# Altium project PCB_Project.PrjPcb
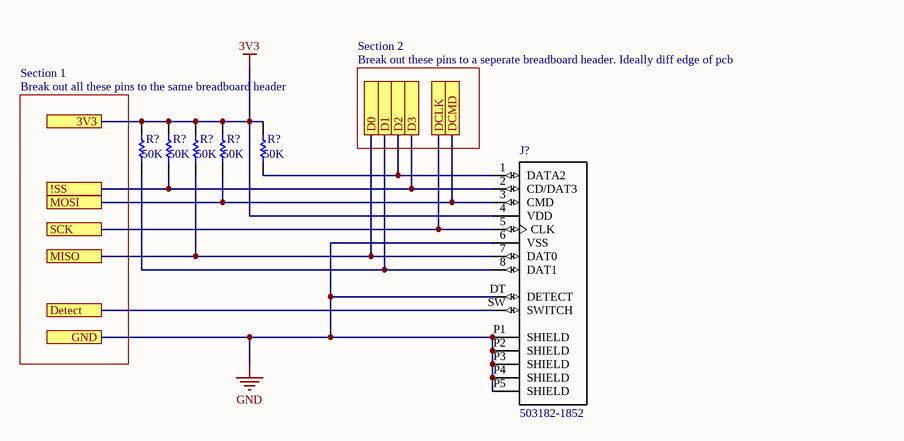
[diagram p0: SDCard.SchDoc]
5 sheets, 27 parts. Net scope: flat (ports and power ports of the same name join across sheets).
Sheets:
  SDCard.SchDoc
  GPS.SchDoc
  Analog.SchDoc
  CAN.SchDoc
  STM32_Base.SchDoc

## Sheet SDCard.SchDoc
size A

### Parts
(Parts that share a designator on the sheet are numbered #1, #2 ... from top to bottom, then left to right.)
J?  503182-1852  [*MOLEX_503182-1852_503182-1852(Primary)]
R?#1  value 50K  [AXIAL-0.3]  (hidden comment: Res1)
R?#2  value 50K  [AXIAL-0.3]  (hidden comment: Res1)
R?#3  value 50K  [AXIAL-0.3]  (hidden comment: Res1)
R?#4  value 50K  [AXIAL-0.3]  (hidden comment: Res1)
R?#5  value 50K  [AXIAL-0.3]  (hidden comment: Res1)

### Sub-sheets
Section 1 = Break out all these pins to the same breadboard header (file not in this document): no entries
Section 2 = Break out these pins to a seperate breadboard header. Ideally diff edge of pcb (file not in this document): no entries

### Ports
3V3, !SS, D0, D1, D2, D3, DCLK, DCMD, Detect, GND, MISO, MOSI, SCK

### Nets
3V3: J?.4(VDD) R?#1.1 R?#2.1 R?#3.1 R?#4.1 R?#5.1 ; port 3V3
GND: J?.6(VSS) J?.DT(DETECT) J?.P1(SHIELD) J?.P2(SHIELD) J?.P3(SHIELD) J?.P4(SHIELD) J?.P5(SHIELD) ; port GND
NetJ?_1: J?.1(DATA2) R?#5.2 ; port D2
NetJ?_2: J?.2(CD/DAT3) R?#2.2 ; port !SS, port D3
NetJ?_3: J?.3(CMD) R?#4.2 ; port MOSI, port DCMD
NetJ?_5: J?.5(CLK) ; port SCK, port DCLK
NetJ?_7: J?.7(DAT0) R?#3.2 ; port MISO, port D0
NetJ?_8: J?.8(DAT1) R?#1.2 ; port D1
NetJ?_SW: J?.SW(SWITCH) ; port Detect

### Library data of the parts
J? = 503182-1852: / 10 _8 + 2_ Position Card Connector microSDâ„¢ Surface Mount, Right Angle Gold /; MF: Molex; MP: 5031821852; Digi-Key_Purchase_URL: https://www.digikey.com/product-detail/en/molex/5031821852/WM12834CT-ND/5823232?utm_source=snapeda&utm_medium=aggregator&utm_campaign=symbol; Package: None; SnapEDA_Link: https://www.snapeda.com/parts/5031821852/Molex/view-part/46835/?ref=snap; Digi-Key_Part_Number: WM12834CT-ND; Value: *
R?#1-R?#5 = Res1: Resistor; Published: 8-Jun-2000; LatestRevisionDate: 17-Jul-2002; LatestRevisionNote: Re-released for DXP Platform.; PackageReference: AXIAL-0.3; Publisher: Altium Limited; PackageDescription: Axial Device, Thru-Hole; 2 Leads; 0.3 in Pin Spacing

## Sheet GPS.SchDoc
size A
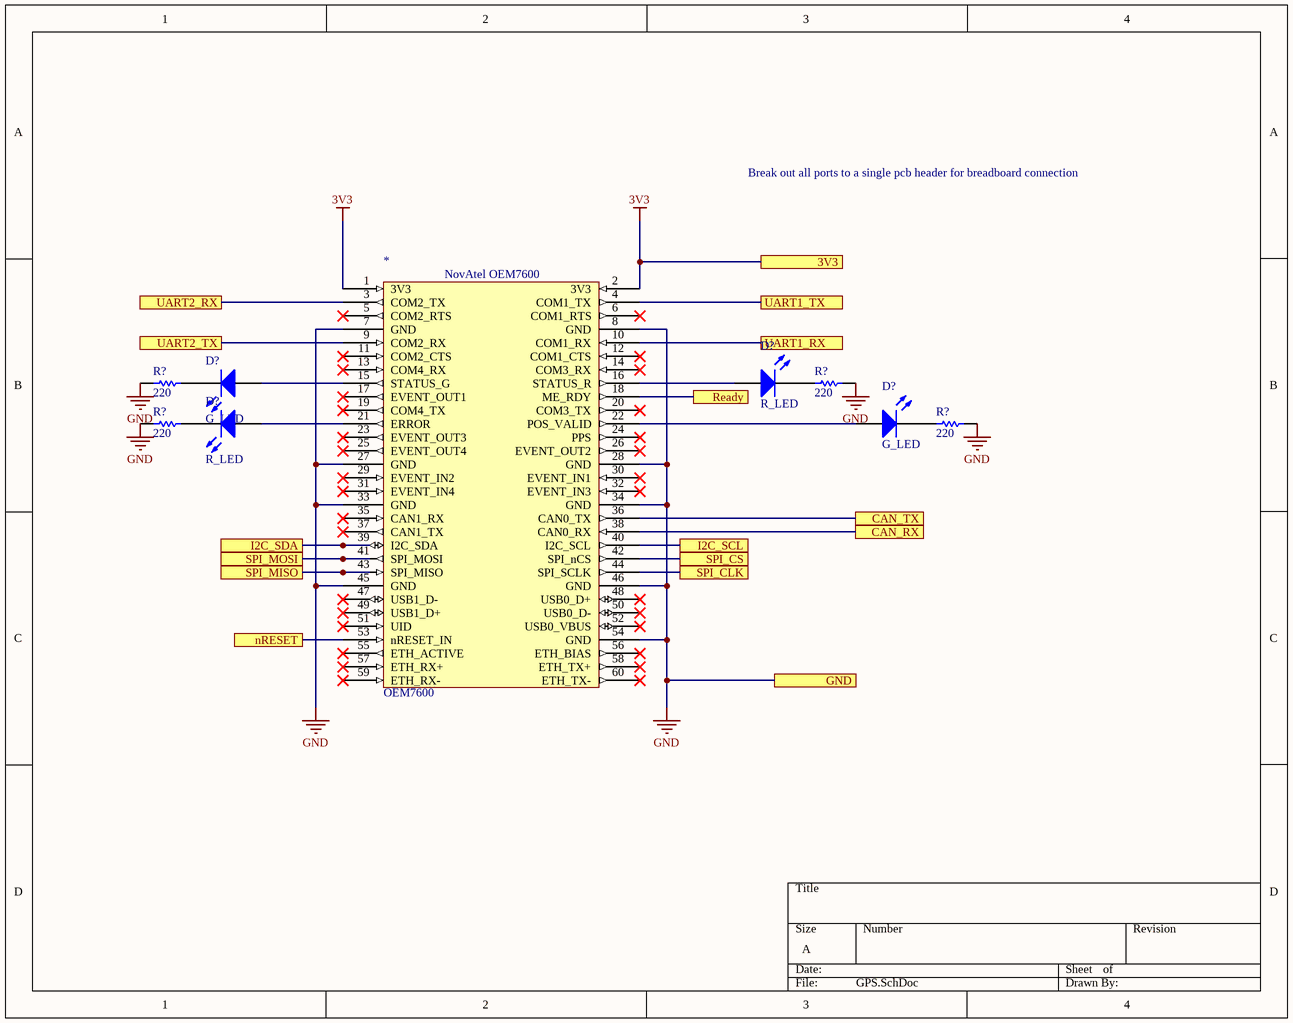
[diagram p1: GPS.SchDoc]

### Parts
(Parts that share a designator on the sheet are numbered #1, #2 ... from top to bottom, then left to right.)
*  OEM7600
D?#1  R_LED  [3.2X1.6X1.1]
D?#2  G_LED  [3.2X1.6X1.1]
D?#3  G_LED  [3.2X1.6X1.1]
D?#4  R_LED  [3.2X1.6X1.1]
R?#6  value 220  [AXIAL-0.3]  (hidden comment: Res1)
R?#7  value 220  [AXIAL-0.3]  (hidden comment: Res1)
R?#8  value 220  [AXIAL-0.3]  (hidden comment: Res1)
R?#9  value 220  [AXIAL-0.3]  (hidden comment: Res1)

### Ports
3V3, CAN_RX, CAN_TX, GND, I2C_SCL, I2C_SDA, nRESET, Ready, SPI_CLK, SPI_CS, SPI_MISO, SPI_MOSI, UART1_RX, UART1_TX, UART2_RX, UART2_TX

### Nets
3V3: *.1(3V3) *.2(3V3) ; port 3V3
GND: *.7(GND) *.8(GND) *.27(GND) *.28(GND) *.33(GND) *.34(GND) *.45(GND) *.46(GND) *.54(GND) R?#6.1 R?#7.2 R?#8.1 R?#9.2 ; port GND
Net*_3: *.3(COM2_TX) ; port UART2_RX
Net*_4: *.4(COM1_TX) ; port UART1_TX
Net*_9: *.9(COM2_RX) ; port UART2_TX
Net*_10: *.10(COM1_RX) ; port UART1_RX
Net*_15: *.15(STATUS_G) D?#2.1(A)
Net*_16: *.16(STATUS_R) D?#1.1(A)
Net*_18: *.18(ME_RDY) ; port Ready
Net*_21: *.21(ERROR) D?#4.1(A)
Net*_22: *.22(POS_VALID) D?#3.1(A)
Net*_36: *.36(CAN0_TX) ; port CAN_TX
Net*_38: *.38(CAN0_RX) ; port CAN_RX
Net*_39: *.39(I2C_SDA) ; port I2C_SDA
Net*_40: *.40(I2C_SCL) ; port I2C_SCL
Net*_41: *.41(SPI_MOSI) ; port SPI_MOSI
Net*_42: *.42(SPI_nCS) ; port SPI_CS
Net*_43: *.43(SPI_MISO) ; port SPI_MISO
Net*_44: *.44(SPI_SCLK) ; port SPI_CLK
Net*_53: *.53(nRESET_IN) ; port nRESET
NetD?#1_2: D?#1.2(K) R?#7.1
NetD?#2_2: D?#2.2(K) R?#6.2
NetD?#3_2: D?#3.2(K) R?#9.1
NetD?#4_2: D?#4.2(K) R?#8.2

Not connected (* = marked no-connect by the designer): * 5(COM2_RTS)* 6(COM1_RTS)* 11(COM2_CTS)* 12(COM1_CTS)* 13(COM4_RX)* 14(COM3_RX)* 17(EVENT_OUT1)* 19(COM4_TX)* 20(COM3_TX)* 23(EVENT_OUT3)* 24(PPS)* 25(EVENT_OUT4)* 26(EVENT_OUT2)* 29(EVENT_IN2)* 30(EVENT_IN1)* 31(EVENT_IN4)* 32(EVENT_IN3)* 35(CAN1_RX)* 37(CAN1_TX)* 47(USB1_D-)* 48(USB0_D+)* 49(USB1_D+)* 50(USB0_D-)* 51(UID)* 52(USB0_VBUS)* 55(ETH_ACTIVE)* 56(ETH_BIAS)* 57(ETH_RX+)* 58(ETH_TX+)* 59(ETH_RX-)* 60(ETH_TX-)*

### Notes on the sheet
- Break out all ports to a single pcb header for breadboard connection
- (in symbol OEM7600) NovAtel OEM7600

### Library data of the parts
D?#1-D?#4 = LED2: Typical RED, GREEN, YELLOW, AMBER GaAs LED; Published: 8-Jun-2000; LatestRevisionDate: 17-Jul-2002; LatestRevisionNote: Re-released for DXP Platform.; PackageVersion: Feb-2002; PackageReference: 3.2X1.6X1.1; Publisher: Altium Limited; PackageDescription: SM LED; 2 Flat Leads
R?#6-R?#9 = Res1: Resistor; Published: 8-Jun-2000; LatestRevisionDate: 17-Jul-2002; LatestRevisionNote: Re-released for DXP Platform.; PackageReference: AXIAL-0.3; Publisher: Altium Limited; PackageDescription: Axial Device, Thru-Hole; 2 Leads; 0.3 in Pin Spacing
* = OEM7600: ComponentLink1Description: Connector Sheet; ComponentLink1URL: https://docs.novatel.com/OEM7/Content/Technical_Specs_Receiver/OEM7600_Interface_Connector.htm

## Sheet Analog.SchDoc
size A
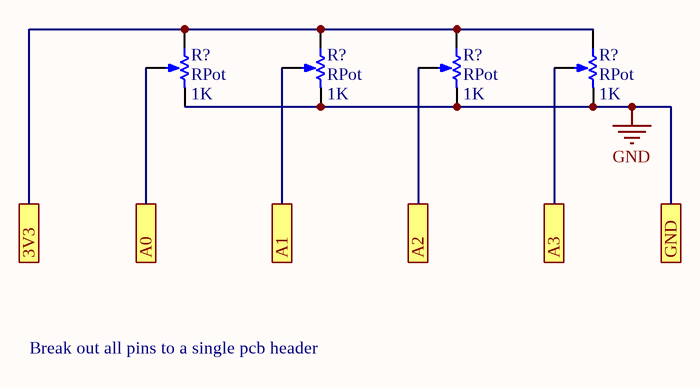
[diagram p2: Analog.SchDoc]

### Parts
(Parts that share a designator on the sheet are numbered #1, #2 ... from top to bottom, then left to right.)
R?#10  RPot  value 1K  [VR5]
R?#11  RPot  value 1K  [VR5]
R?#12  RPot  value 1K  [VR5]
R?#13  RPot  value 1K  [VR5]

### Ports
3V3, A0, A1, A2, A3, GND

### Nets
3V3: R?#10.1(TOP) R?#11.1(TOP) R?#12.1(TOP) R?#13.1(TOP) ; port 3V3
GND: R?#10.2(BOT) R?#11.2(BOT) R?#12.2(BOT) R?#13.2(BOT) ; port GND
NetR?#10_3: R?#10.3(TAP) ; port A0
NetR?#11_3: R?#11.3(TAP) ; port A1
NetR?#12_3: R?#12.3(TAP) ; port A2
NetR?#13_3: R?#13.3(TAP) ; port A3

### Notes on the sheet
- Break out all pins to a single pcb header

### Library data of the parts
R?#10-R?#13 = RPot: Potentiometer; Sim Note: Enter the Resistance value and the set point into parameter fields.; Set Position: 0.5; Published: 8-Jun-2000; LatestRevisionDate: 17-Jul-2002; LatestRevisionNote: Re-released for DXP Platform.; PackageReference: VR5; Publisher: Altium Limited; PackageDescription: Variable Resistor, Thru-Hole; 3 Leads

## Sheet CAN.SchDoc
size A
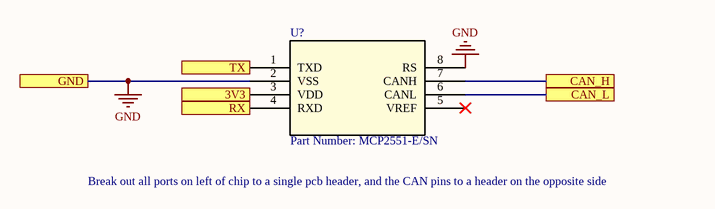
[diagram p3: CAN.SchDoc]

### Parts
(Parts that share a designator on the sheet are numbered #1, #2 ... from top to bottom, then left to right.)
U?#1  Part Number: MCP2551-E/SN  [SOIC8-N_MC]

### Ports
3V3, CAN_H, CAN_L, GND, RX, TX

### Nets
3V3: U?#1.3(VDD) ; port 3V3
GND: U?#1.2(VSS) U?#1.8(RS) ; port GND
NetU?#1_1: U?#1.1(TXD) ; port TX
NetU?#1_4: U?#1.4(RXD) ; port RX
NetU?#1_6: U?#1.6(CANL) ; port CAN_L
NetU?#1_7: U?#1.7(CANH) ; port CAN_H

Not connected (* = marked no-connect by the designer): U?#1 5(VREF)*

### Notes on the sheet
- Break out all ports on left of chip to a single pcb header, and the CAN pins to a header on the opposite side

### Library data of the parts
U?#1 = MCP2551-E/SN: No Description Available; Vendor: Microchip; Built_By: EMA_Jessica; Manufacturer_Part_Number: MCP2551-E/SN; Copyright: Copyright (C) 2018 Accelerated Designs. All rights reserved; RefDes: RefDes; Type: DEV; Value: Value

## Sheet STM32_Base.SchDoc
size A
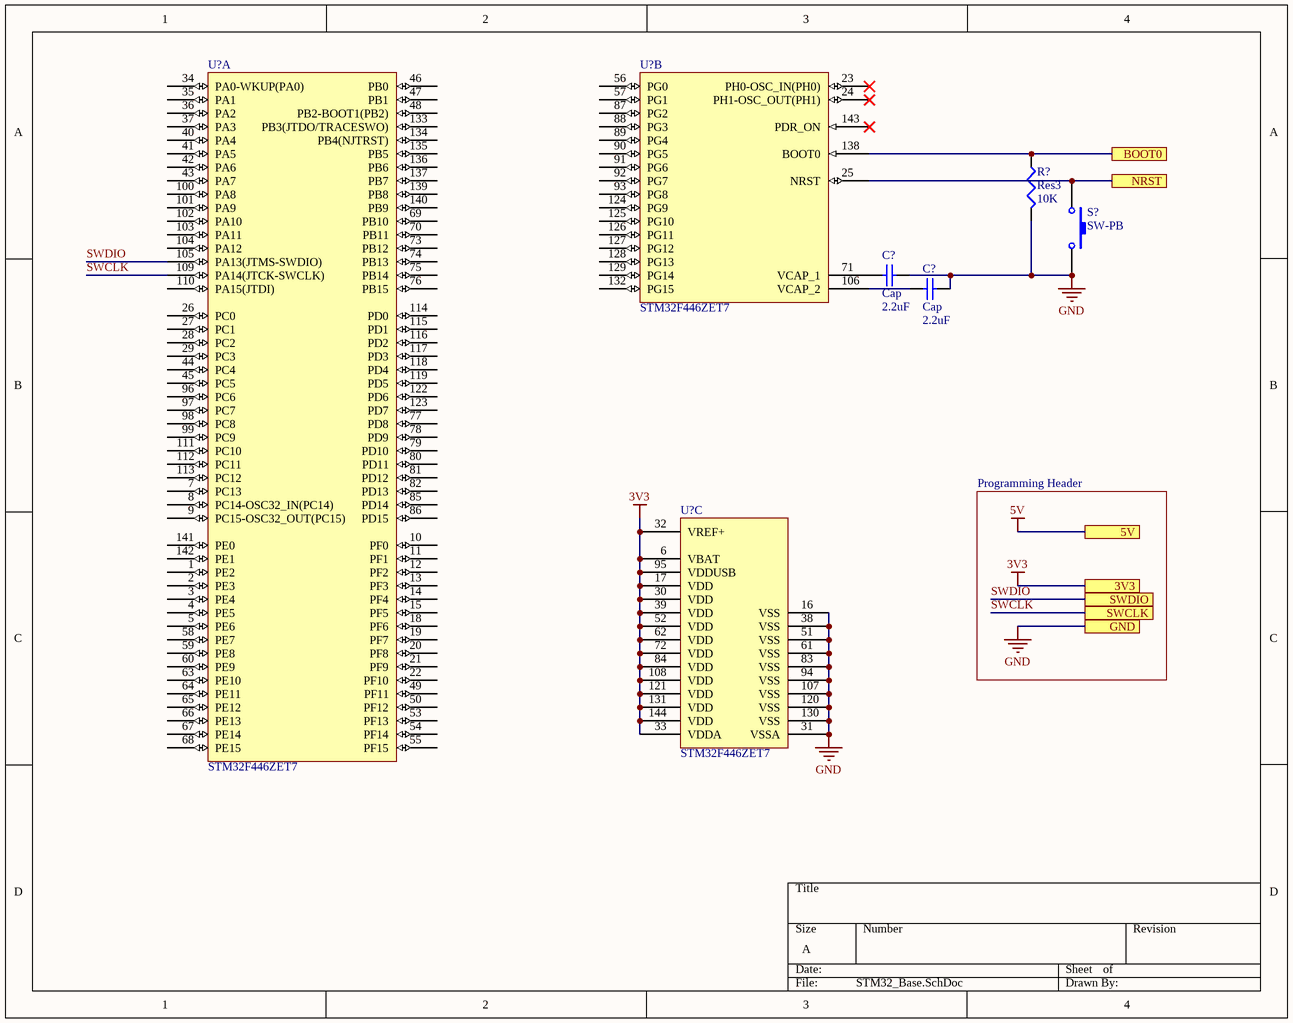
[diagram p4: STM32_Base.SchDoc]

### Parts
(Parts that share a designator on the sheet are numbered #1, #2 ... from top to bottom, then left to right.)
C?#1  Cap  value 2.2uF  [RAD-0.3]
C?#2  Cap  value 2.2uF  [RAD-0.3]
R?#14  Res3  value 10K  [J1-0603]
S?  SW-PB  [SPST-2]
U?#2  STM32F446ZET7  [STM-LQFP144_M]  (part A of 3)
U?#3  STM32F446ZET7  [STM-LQFP144_M]  (part B of 3)
U?#4  STM32F446ZET7  [STM-LQFP144_M]  (part C of 3)

### Sub-sheets
Programming Header = File Name (file not in this document): no entries

### Ports
3V3, 5V, BOOT0, GND, NRST, SWCLK, SWDIO

### Nets
3V3: U?#4.6(VBAT) U?#4.17(VDD) U?#4.30(VDD) U?#4.32(VREF+) U?#4.33(VDDA) U?#4.39(VDD) U?#4.52(VDD) U?#4.62(VDD) U?#4.72(VDD) U?#4.84(VDD) U?#4.95(VDDUSB) U?#4.108(VDD) U?#4.121(VDD) U?#4.131(VDD) U?#4.144(VDD) ; port 3V3
5V: port 5V
GND: C?#1.2 C?#2.2 R?#14.2 S?.2 U?#4.16(VSS) U?#4.31(VSSA) U?#4.38(VSS) U?#4.51(VSS) U?#4.61(VSS) U?#4.83(VSS) U?#4.94(VSS) U?#4.107(VSS) U?#4.120(VSS) U?#4.130(VSS) ; port GND
SWCLK: U?#2.109(PA14(JTCK-SWCLK)) ; port SWCLK
SWDIO: U?#2.105(PA13(JTMS-SWDIO)) ; port SWDIO
NetC?#1_1: C?#1.1 U?#3.71(VCAP_1)
NetC?#2_1: C?#2.1 U?#3.106(VCAP_2)
NetR?#14_1: R?#14.1 U?#3.138(BOOT0) ; port BOOT0
NetS?_1: S?.1 U?#3.25(NRST) ; port NRST

Not connected (* = marked no-connect by the designer): U?#2 1(PE2) 2(PE3) 3(PE4) 4(PE5) 5(PE6) 7(PC13) 8(PC14-OSC32_IN(PC14)) 9(PC15-OSC32_OUT(PC15)) 10(PF0) 11(PF1) 12(PF2) 13(PF3) 14(PF4) 15(PF5) 18(PF6) 19(PF7) 20(PF8) 21(PF9) 22(PF10) 26(PC0) 27(PC1) 28(PC2) 29(PC3) 34(PA0-WKUP(PA0)) 35(PA1) 36(PA2) 37(PA3) 40(PA4) 41(PA5) 42(PA6) 43(PA7) 44(PC4) 45(PC5) 46(PB0) 47(PB1) 48(PB2-BOOT1(PB2)) 49(PF11) 50(PF12) 53(PF13) 54(PF14) 55(PF15) 58(PE7) 59(PE8) 60(PE9) 63(PE10) 64(PE11) 65(PE12) 66(PE13) 67(PE14) 68(PE15) 69(PB10) 70(PB11) 73(PB12) 74(PB13) 75(PB14) 76(PB15) 77(PD8) 78(PD9) 79(PD10) 80(PD11) 81(PD12) 82(PD13) 85(PD14) 86(PD15) 96(PC6) 97(PC7) 98(PC8) 99(PC9) 100(PA8) 101(PA9) 102(PA10) 103(PA11) 104(PA12) 110(PA15(JTDI)) 111(PC10) 112(PC11) 113(PC12) 114(PD0) 115(PD1) 116(PD2) 117(PD3) 118(PD4) 119(PD5) 122(PD6) 123(PD7) 133(PB3(JTDO/TRACESWO)) 134(PB4(NJTRST)) 135(PB5) 136(PB6) 137(PB7) 139(PB8) 140(PB9) 141(PE0) 142(PE1); U?#3 23(PH0-OSC_IN(PH0))* 24(PH1-OSC_OUT(PH1))* 56(PG0) 57(PG1) 87(PG2) 88(PG3) 89(PG4) 90(PG5) 91(PG6) 92(PG7) 93(PG8) 124(PG9) 125(PG10) 126(PG11) 127(PG12) 128(PG13) 129(PG14) 132(PG15) 143(PDR_ON)*

### Library data of the parts
C?#1 C?#2 = Cap: Capacitor; Published: 8-Jun-2000; LatestRevisionDate: 17-Jul-2002; LatestRevisionNote: Re-released for DXP Platform.; PackageReference: RAD-0.3; Publisher: Altium Limited; PackageDescription: Radial Cap, Thru-Hole; 2 Leads; 0.3 in Pin Spacing
R?#14 = Res3: Resistor; Published: 8-Jun-2000; LatestRevisionDate: 29-May-2009; LatestRevisionNote: IPC-7351 Footprint Added.; PackageReference: J1-0603; Publisher: Altium Limited; PackageDescription: Chip Resistor
S? = SW-PB: Switch; Published: 24-Mar-1999; LatestRevisionDate: 17-Jul-2002; LatestRevisionNote: Re-released for DXP Platform.; PackageReference: SPST-2; Publisher: Altium Limited; PackageDescription: Switch; 2 Leads
U?#2-U?#4 = CMP-0243-00227-1: ARM Cortex-M4 32-bit MCU+FPU, 512 KB Flash, 128 KB Internal RAM, 114 I/Os, 144-Pin LQFP, -40 to 105 degC, Tray; Operating Frequency(F) (Processor speed) (MHz): 180; FLASH Size (Prog) (kB): 512; D/A Converter: 2; Internal RAM Size (kB): 128; I/Os (High Current): 114; Supply Voltage(Vcc) min (V): 1.7; Package Reference: 144-Pin Low Profile Quad Flat Package, Body 20 x 20 mm, Pitch 0.5 mm; Package Description: LQFP144; DatasheetVersion: Rev. 6; ComponentLink2Description: Datasheet; Mounting Technology: Surface Mount; Packing: Tray; ComponentLink2URL: http://www.st.com/st-web-ui/static/active/en/resource/technical/document/datasheet/DM00141306.pdf; Core: ARM Cortex-M4; ComponentLink1URL: http://www.st.com/; ComponentLink1Description: Manufacturer URL

## Nets that join several sheets
3V3: SDCard (6 pins), GPS (*.1 *.2), Analog (R?#10.1 R?#11.1 R?#12.1 R?#13.1), CAN (U?#1.3), STM32_Base (15 pins)
GND: SDCard (7 pins), GPS (13 pins), Analog (R?#10.2 R?#11.2 R?#12.2 R?#13.2), CAN (U?#1.2 U?#1.8), STM32_Base (14 pins)